# EasyEDA schematic MyExomy.json
TITLE: MyExomy; REV: 1.0; Date: 2021-04-03; Sheet: 1/1; Company: Your Company
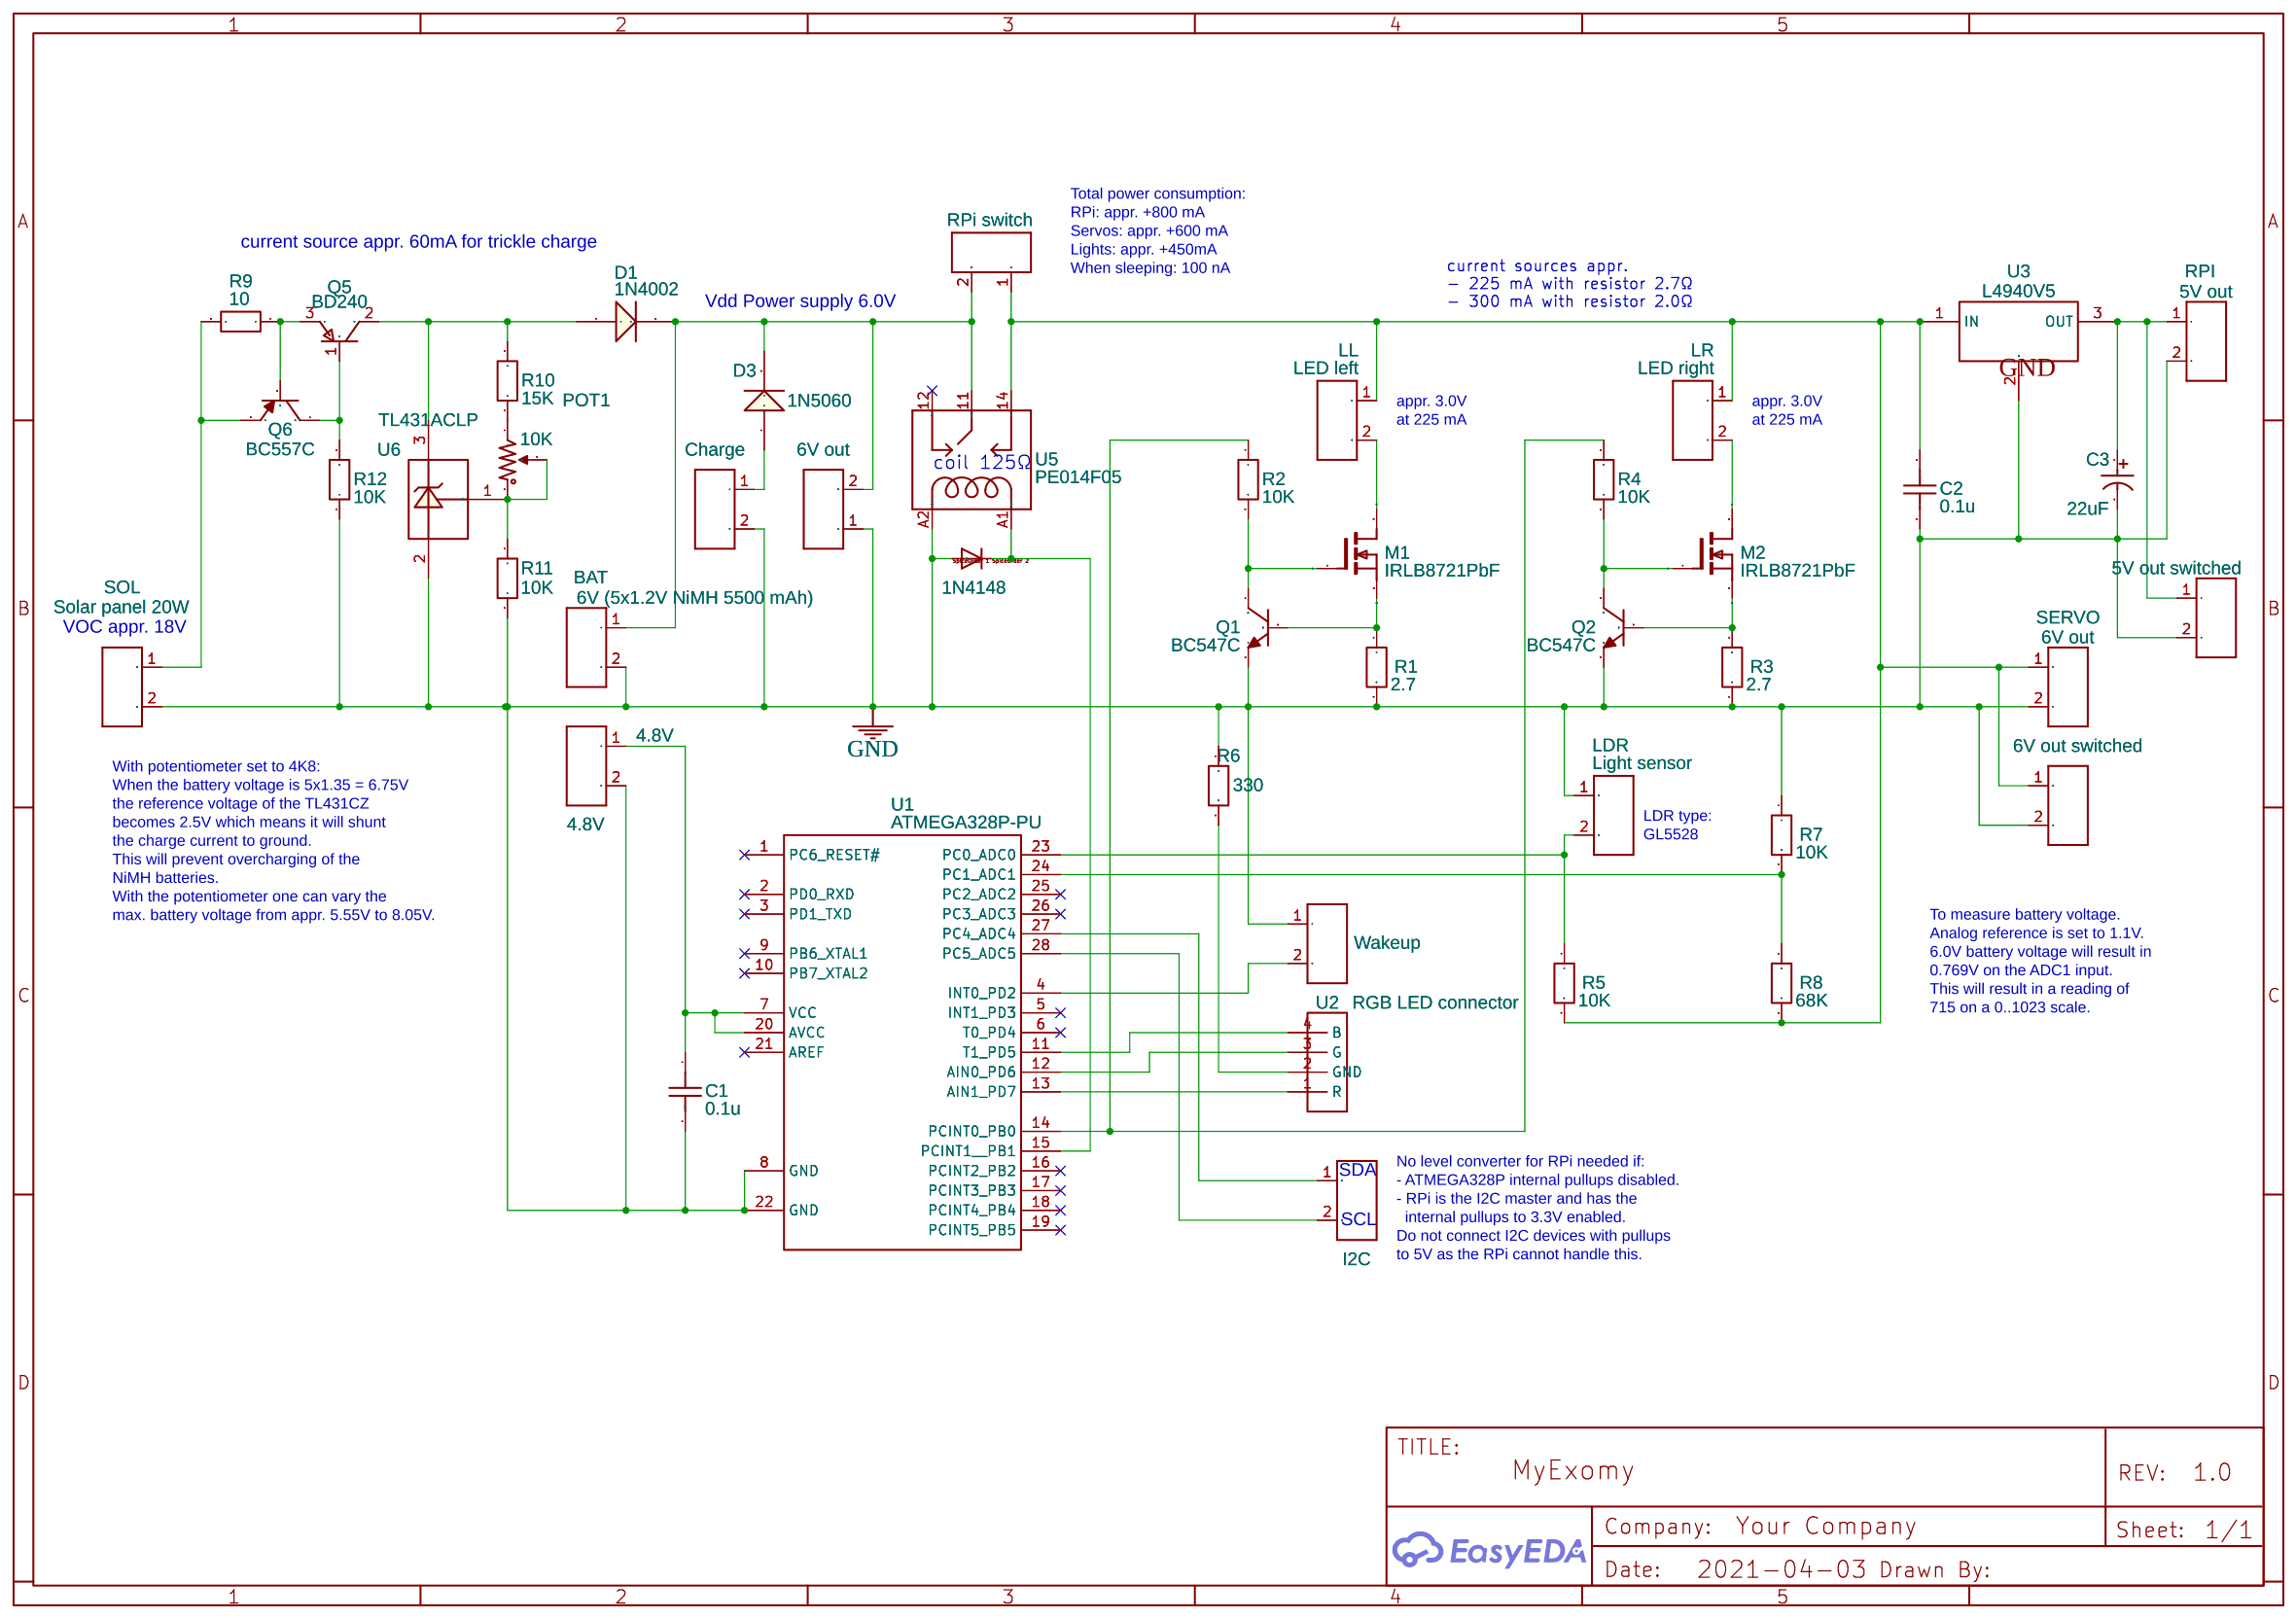
[diagram p0: schematic sheet]

## Parts
4.8V  4.8V  [H2-5.0-10.5X8.0MM]
5VSWTITCHED  5V out switched  [H2-5.0-10.5X8.0MM]
6VOUT  6V out  [H2-5.0-10.5X8.0MM]
6VSWITCHED  6V out switched  [H2-5.0-10.5X8.0MM]
BAT  6V (5x1.2V NiMH 5500 mAh)  [H2-5.0-10.5X8.0MM]
C1  0.1u  [CONDENSATOR 0.1UF]
C2  0.1u  [CONDENSATOR 0.1UF]
C3  22uF  [CAP-D5]
CHARGE  Charge  [H2-5.0-10.5X8.0MM]
D1  1N4002  [DO-41]
D2  1N4148  [DO35-10]
D3  1N5060  [DO-41]
I2C  I2C  [H2-5.0-10.5X8.0MM]
LDR  Light sensor  [H2-5.0-10.5X8.0MM]
LL  LED left  [H2-5.0-10.5X8.0MM]
LR  LED right  [H2-5.0-10.5X8.0MM]
M1  IRLB8721PbF  [T0220AB]
M2  IRLB8721PbF  [T0220AB]
POT1  10K  [RES-ADJ_3296W]
Q1  BC547C  [TO-92-3_L4.9-W3.7-P1.27-L]
Q2  BC547C  [TO-92-3_L4.9-W3.7-P1.27-L]
Q5  BD240  [TO-220]
Q6  BC557C  [TO-92-3_L4.9-W3.7-P1.27-L]
R1  2.7  [RESISTOR-1/4W-HORIZONTAL]
R2  10K  [RESISTOR-1/4W-HORIZONTAL]
R3  2.7  [RESISTOR-1/4W-HORIZONTAL]
R4  10K  [RESISTOR-1/4W-HORIZONTAL]
R5  10K  [RESISTOR-1/4W-HORIZONTAL]
R6  330  [RESISTOR-1/4W-HORIZONTAL]
R7  10K  [RESISTOR-1/4W-HORIZONTAL]
R8  68K  [RESISTOR-1/4W-HORIZONTAL]
R9  10  [RESISTOR-1/4W-HORIZONTAL]
R10  15K  [RESISTOR-1/4W-HORIZONTAL]
R11  10K  [RESISTOR-1/4W-HORIZONTAL]
R12  10K  [RESISTOR-1/4W-HORIZONTAL]
RPI  5V out  [H2-5.0-10.5X8.0MM]
RPISWITCH  RPi switch  [H2-5.0-10.5X8.0MM]
SERVO  6V out  [H2-5.0-10.5X8.0MM]
SOL  Solar panel 20W  [H2-5.0-10.5X8.0MM]
U1  ATMEGA328P-PU  [DIP-28_L34.6-W7.3-P2.54-LS10.2-BL]
U2  RGB LED connector  [RGB LED CONNECTOR]
U3  L4940V5  [TO-220-3_L10.0-W4.5-P2.54-T]
U5  PE014F05  [PE014F05]
U6  TL431ACLP  [TO-92-3_L4.9-W3.7-P1.27-L]
WAKEUP  Wakeup  [H2-5.0-10.5X8.0MM]

## Library data of the parts
4.8V 5VSWTITCHED 6VOUT 6VSWITCHED BAT CHARGE I2C LDR LL LR RPI RPISWITCH SERVO SOL WAKEUP = Screw Terminal: Manufacturer Part: ?
C1 C2 = C_0603_US: Contributor: LCEDA_Lib
C3 = 22uF: Contributor: LCSC
D1 D3 = 1N4002: 1.0 Ampere General Purpose Rectifier
D2 = 1N4148DO35-10: DIODE
M1 M2 = BSS123: Contributor: EasyEDA
POT1 = POTENTIOMETER 10 TURN: Model: Potentiometer; K(%): 50
Q1 Q2 = BC547C: Supplier: LCSC; Supplier Part: C713614; Manufacturer: LGE; Contributor: LCSC
Q5 = BD240: Complementary Silicon Plastic Power Transistor, 3-Pin TO-220, Tube; Contributor: Nekito80
Q6 = BC557C: Supplier: LCSC; Supplier Part: C713618; Manufacturer: LGE; Contributor: LCSC; LCSC Assembly: Yes; SMT Type: Extend; Paste Type: expand
R1-R12 = Resistor_EU: Contributor: EasyEDA; Resistance: 1K
U1 = ATMEGA328P-PU: sourceId: Oic6oiASL; Supplier: LCSC; Manufacturer: MICROCHIP; image: //image.lceda.cn/szlcsc/C33901.jpg; Contributor: LCSC; Supplier Part: C33901
U2 = RGB LED connector: Contributor: Guest
U3 = L4940V5: Supplier: LCSC; Manufacturer: STMicroelectronics; Supplier Part: C92218
U5 = PE014F05: Contributor: renerenerene
U6 = TL431ACLP: Supplier: LCSC; Manufacturer: TI; image: //image.lceda.cn/szlcsc/C5234.jpg; Supplier Part: C5234; LCSC Assembly: Yes; SMT Type: Extend; Paste Type: expand

## Nets
GND: 4.8V.2 5VSWTITCHED.2 6VOUT.1 6VSWITCHED.2 BAT.2 C1.2 C2.2 C3.2 CHARGE.2 D2.A LDR.1 Q1.3(E) Q2.3(E) R1.2 R3.2 R6.1 R7.1 R11.1 R12.1 RPI.2 SERVO.2 SOL.2 U1.8(GND) U1.22(GND) U3.2(GND) U5.A2(COIL1) U6.2(A) WAKEUP.1
Net-(4.8V-1): 4.8V.1 C1.1 U1.7(VCC) U1.20(AVCC)
Net-(5VSWTITCHED-1): 5VSWTITCHED.1 C3.1 RPI.1 U3.3(OUT)
Net-(6VOUT-2): 6VOUT.2 BAT.1 D1.2(K) D3.2(K) RPISWITCH.2 U5.11(MAIN)
Net-(6VSWITCHED-1): 6VSWITCHED.1 C2.1 LL.1 LR.1 R5.2 R8.2 RPISWITCH.1 SERVO.1 U3.1(IN) U5.14(NO)
Net-(CHARGE-1): CHARGE.1 D3.1(A)
Net-(D1-1): D1.1(A) Q5.2(C) R10.2 U6.3(K)
Net-(D2-C): D2.C U1.15(PCINT1  PB1) U5.A1(COIL2)
Net-(I2C-1): I2C.1 U1.27(PC4 ADC4)
Net-(I2C-2): I2C.2 U1.28(PC5 ADC5)
Net-(LDR-2): LDR.2 R5.1 U1.23(PC0 ADC0)
Net-(LL-2): LL.2 M1.2(D)
Net-(LR-2): LR.2 M2.2(D)
Net-(M1-1): M1.1(G) Q1.1(C) R2.2
Net-(M1-3): M1.3(S) Q1.2(B) R1.1
Net-(M2-1): M2.1(G) Q2.1(C) R4.2
Net-(M2-3): M2.3(S) Q2.2(B) R3.1
Net-(POT1-1): POT1.1 R10.1
Net-(POT1-2): POT1.2(3) POT1.3(2) R11.2 U6.1(REF)
Net-(Q5-1): Q5.1(B) Q6.1(C) R12.2
Net-(Q5-3): Q5.3(E) Q6.2(B) R9.1
Net-(Q6-3): Q6.3(E) R9.2 SOL.1
Net-(R2-1): R2.1 R4.1 U1.14(PCINT0 PB0)
Net-(R6-2): R6.2 U2.2(GND)
Net-(R7-2): R7.2 R8.1 U1.24(PC1 ADC1)
Net-(U1-4): U1.4(INT0 PD2) WAKEUP.2
Net-(U1-11): U1.11(T1 PD5) U2.4(B)
Net-(U1-12): U1.12(AIN0 PD6) U2.3(G)
Net-(U1-13): U1.13(AIN1 PD7) U2.1(R)

Not connected (* = marked no-connect by the designer): U1 1(PC6 RESET#)* 2(PD0 RXD)* 3(PD1 TXD)* 5(INT1 PD3)* 6(T0 PD4)* 9(PB6 XTAL1)* 10(PB7 XTAL2)* 16(PCINT2 PB2)* 17(PCINT3 PB3)* 18(PCINT4 PB4)* 19(PCINT5 PB5)* 21(AREF)* 25(PC2 ADC2)* 26(PC3 ADC3)*; U5 12(NC)*

## Notes on the sheet
- Total power consumption:
  RPi: appr. +800 mA
  Servos: appr. +600 mA
  Lights: appr. +450mA
  When sleeping: 100 nA
- current source appr. 60mA for trickle charge
- current sources appr.
  - 225 mA with resistor 2.7Ω
  - 300 mA with resistor 2.0Ω
- Vdd Power supply 6.0V
- appr. 3.0V
  at 225 mA
- appr. 3.0V
  at 225 mA
- coil 125Ω
- VOC appr. 18V
- With potentiometer set to 4K8:
  When the battery voltage is 5x1.35 = 6.75V
  the reference voltage of the TL431CZ
  becomes 2.5V which means it will shunt
  the charge current to ground.
  This will prevent overcharging of the
  NiMH batteries.
  With the potentiometer one can vary the
  max. battery voltage from appr. 5.55V to 8.05V.
- LDR type:
  GL5528
- To measure battery voltage.
  Analog reference is set to 1.1V.
  6.0V battery voltage will result in
  0.769V on the ADC1 input.
  This will result in a reading of
  715 on a 0..1023 scale.
- SDA
- No level converter for RPi needed if:
  - ATMEGA328P internal pullups disabled.
  - RPi is the I2C master and has the
    internal pullups to 3.3V enabled.
  Do not connect I2C devices with pullups
  to 5V as the RPi cannot handle this.
- SCL
